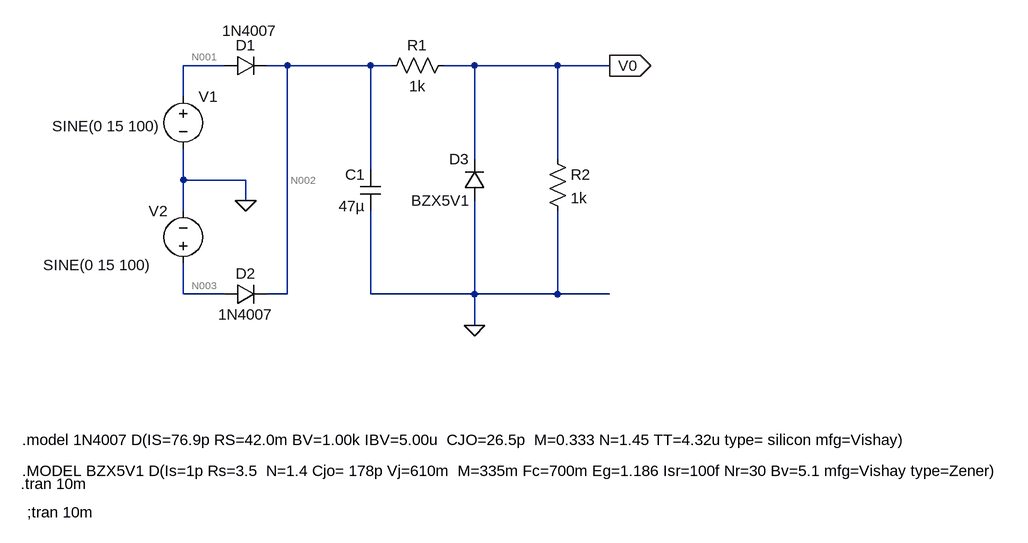
[diagram p0: schematic Draft2.asc]
Draft2.asc, the LTspice schematic file:
Version 4
SHEET 1 1284 704
WIRE 64 0 0 0
WIRE 160 0 128 0
WIRE 288 0 160 0
WIRE 320 0 288 0
WIRE 448 0 400 0
WIRE 576 0 448 0
WIRE 656 0 576 0
WIRE 0 48 0 0
WIRE 448 144 448 0
WIRE 576 144 576 0
WIRE 288 160 288 0
WIRE 0 176 0 128
WIRE 96 176 0 176
WIRE 96 208 96 176
WIRE 0 224 0 176
WIRE 0 352 0 304
WIRE 64 352 0 352
WIRE 160 352 160 0
WIRE 160 352 128 352
WIRE 288 352 288 224
WIRE 448 352 448 208
WIRE 448 352 288 352
WIRE 576 352 576 224
WIRE 576 352 448 352
WIRE 656 352 576 352
WIRE 448 400 448 352
FLAG 448 400 0
FLAG 96 208 0
FLAG 656 0 V0
IOPIN 656 0 Out
SYMBOL voltage 0 32 R0
WINDOW 3 -202 61 Left 2
WINDOW 123 0 0 Left 2
WINDOW 39 0 0 Left 2
SYMATTR InstName V1
SYMATTR Value SINE(0 15 100)
SYMBOL voltage 0 320 R180
WINDOW 0 24 96 Left 2
WINDOW 3 49 13 Left 2
WINDOW 123 0 0 Left 2
WINDOW 39 0 0 Left 2
SYMATTR InstName V2
SYMATTR Value SINE(0 15 100)
SYMBOL diode 64 16 R270
WINDOW 0 32 32 VTop 2
WINDOW 3 85 38 VBottom 2
SYMATTR InstName D1
SYMATTR Value 1N4007
SYMBOL diode 64 368 R270
WINDOW 0 32 32 VTop 2
WINDOW 3 0 32 VBottom 2
SYMATTR InstName D2
SYMATTR Value 1N4007
SYMBOL res 304 16 R270
WINDOW 0 32 56 VTop 2
WINDOW 3 0 56 VBottom 2
SYMATTR InstName R1
SYMATTR Value 1k
SYMBOL diode 464 208 R180
WINDOW 0 24 64 Left 2
WINDOW 3 24 0 Left 2
SYMATTR InstName D3
SYMATTR Value BZX5V1
SYMBOL res 560 128 R0
SYMATTR InstName R2
SYMATTR Value 1k
SYMBOL cap 304 224 R180
WINDOW 0 24 56 Left 2
WINDOW 3 24 8 Left 2
SYMATTR InstName C1
SYMATTR Value 47µ
SYMATTR SpiceLine V=50
TEXT -248 576 Left 2 !.model 1N4007 D(IS=76.9p RS=42.0m BV=1.00k IBV=5.00u  CJO=26.5p  M=0.333 N=1.45 TT=4.32u type= silicon mfg=Vishay)
TEXT -248 624 Left 2 !.MODEL BZX5V1 D(Is=1p Rs=3.5  N=1.4 Cjo= 178p Vj=610m  M=335m Fc=700m Eg=1.186 Isr=100f Nr=30 Bv=5.1 mfg=Vishay type=Zener)
TEXT -250 644 Left 2 !.tran 10m
TEXT -240 688 Left 2 !;tran 10m

The netlist it stands for:
* Draft2.asc
V1 N001 0 SINE(0 15 100)
V2 N003 0 SINE(0 15 100)
D1 N001 N002 1N4007
D2 N003 N002 1N4007
R1 N002 V0 1k
D3 0 V0 BZX5V1
R2 V0 0 1k
C1 0 N002 47µ V=50
.model D D
.lib standard.dio
.model 1N4007 D(IS=76.9p RS=42.0m BV=1.00k IBV=5.00u  CJO=26.5p  M=0.333 N=1.45 TT=4.32u type= silicon mfg=Vishay)
.MODEL BZX5V1 D(Is=1p Rs=3.5  N=1.4 Cjo= 178p Vj=610m  M=335m Fc=700m Eg=1.186 Isr=100f Nr=30 Bv=5.1 mfg=Vishay type=Zener)
.tran 10m
;tran 10m
.backanno
.end

* Results of the author's LTspice run, read from the files saved beside the schematic
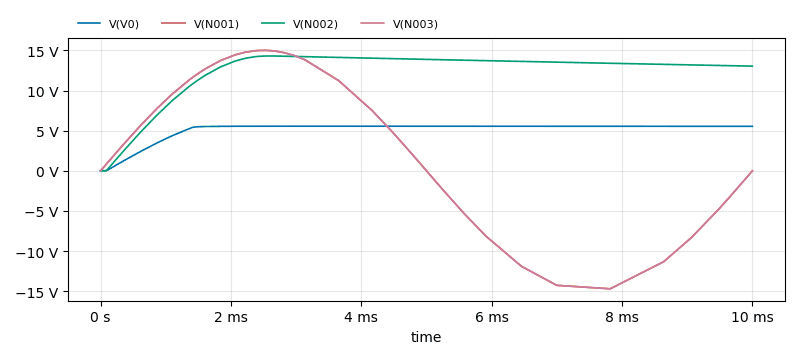
[diagram p1: Transient Analysis of Draft2.asc, plotted from the saved traces]
* Transient Analysis, 1 run:
*   V(V0): min 0 V, max 5.558 V, average 5.148 V, rms 5.281 V, last 5.541 V
*   V(N001): min -14.69 V, max 15 V, average 55.94 mV, rms 10.55 V, last 0 V
*   V(N002): min 0 V, max 14.3 V, average 12.44 V, rms 12.83 V, last 13.04 V
*   V(N003): min -14.69 V, max 15 V, average 55.94 mV, rms 10.55 V, last 0 V